# Altium schematic sheet flight_cont_card.SchDoc
size A3; SheetNumber: 1; SheetTotal: 1
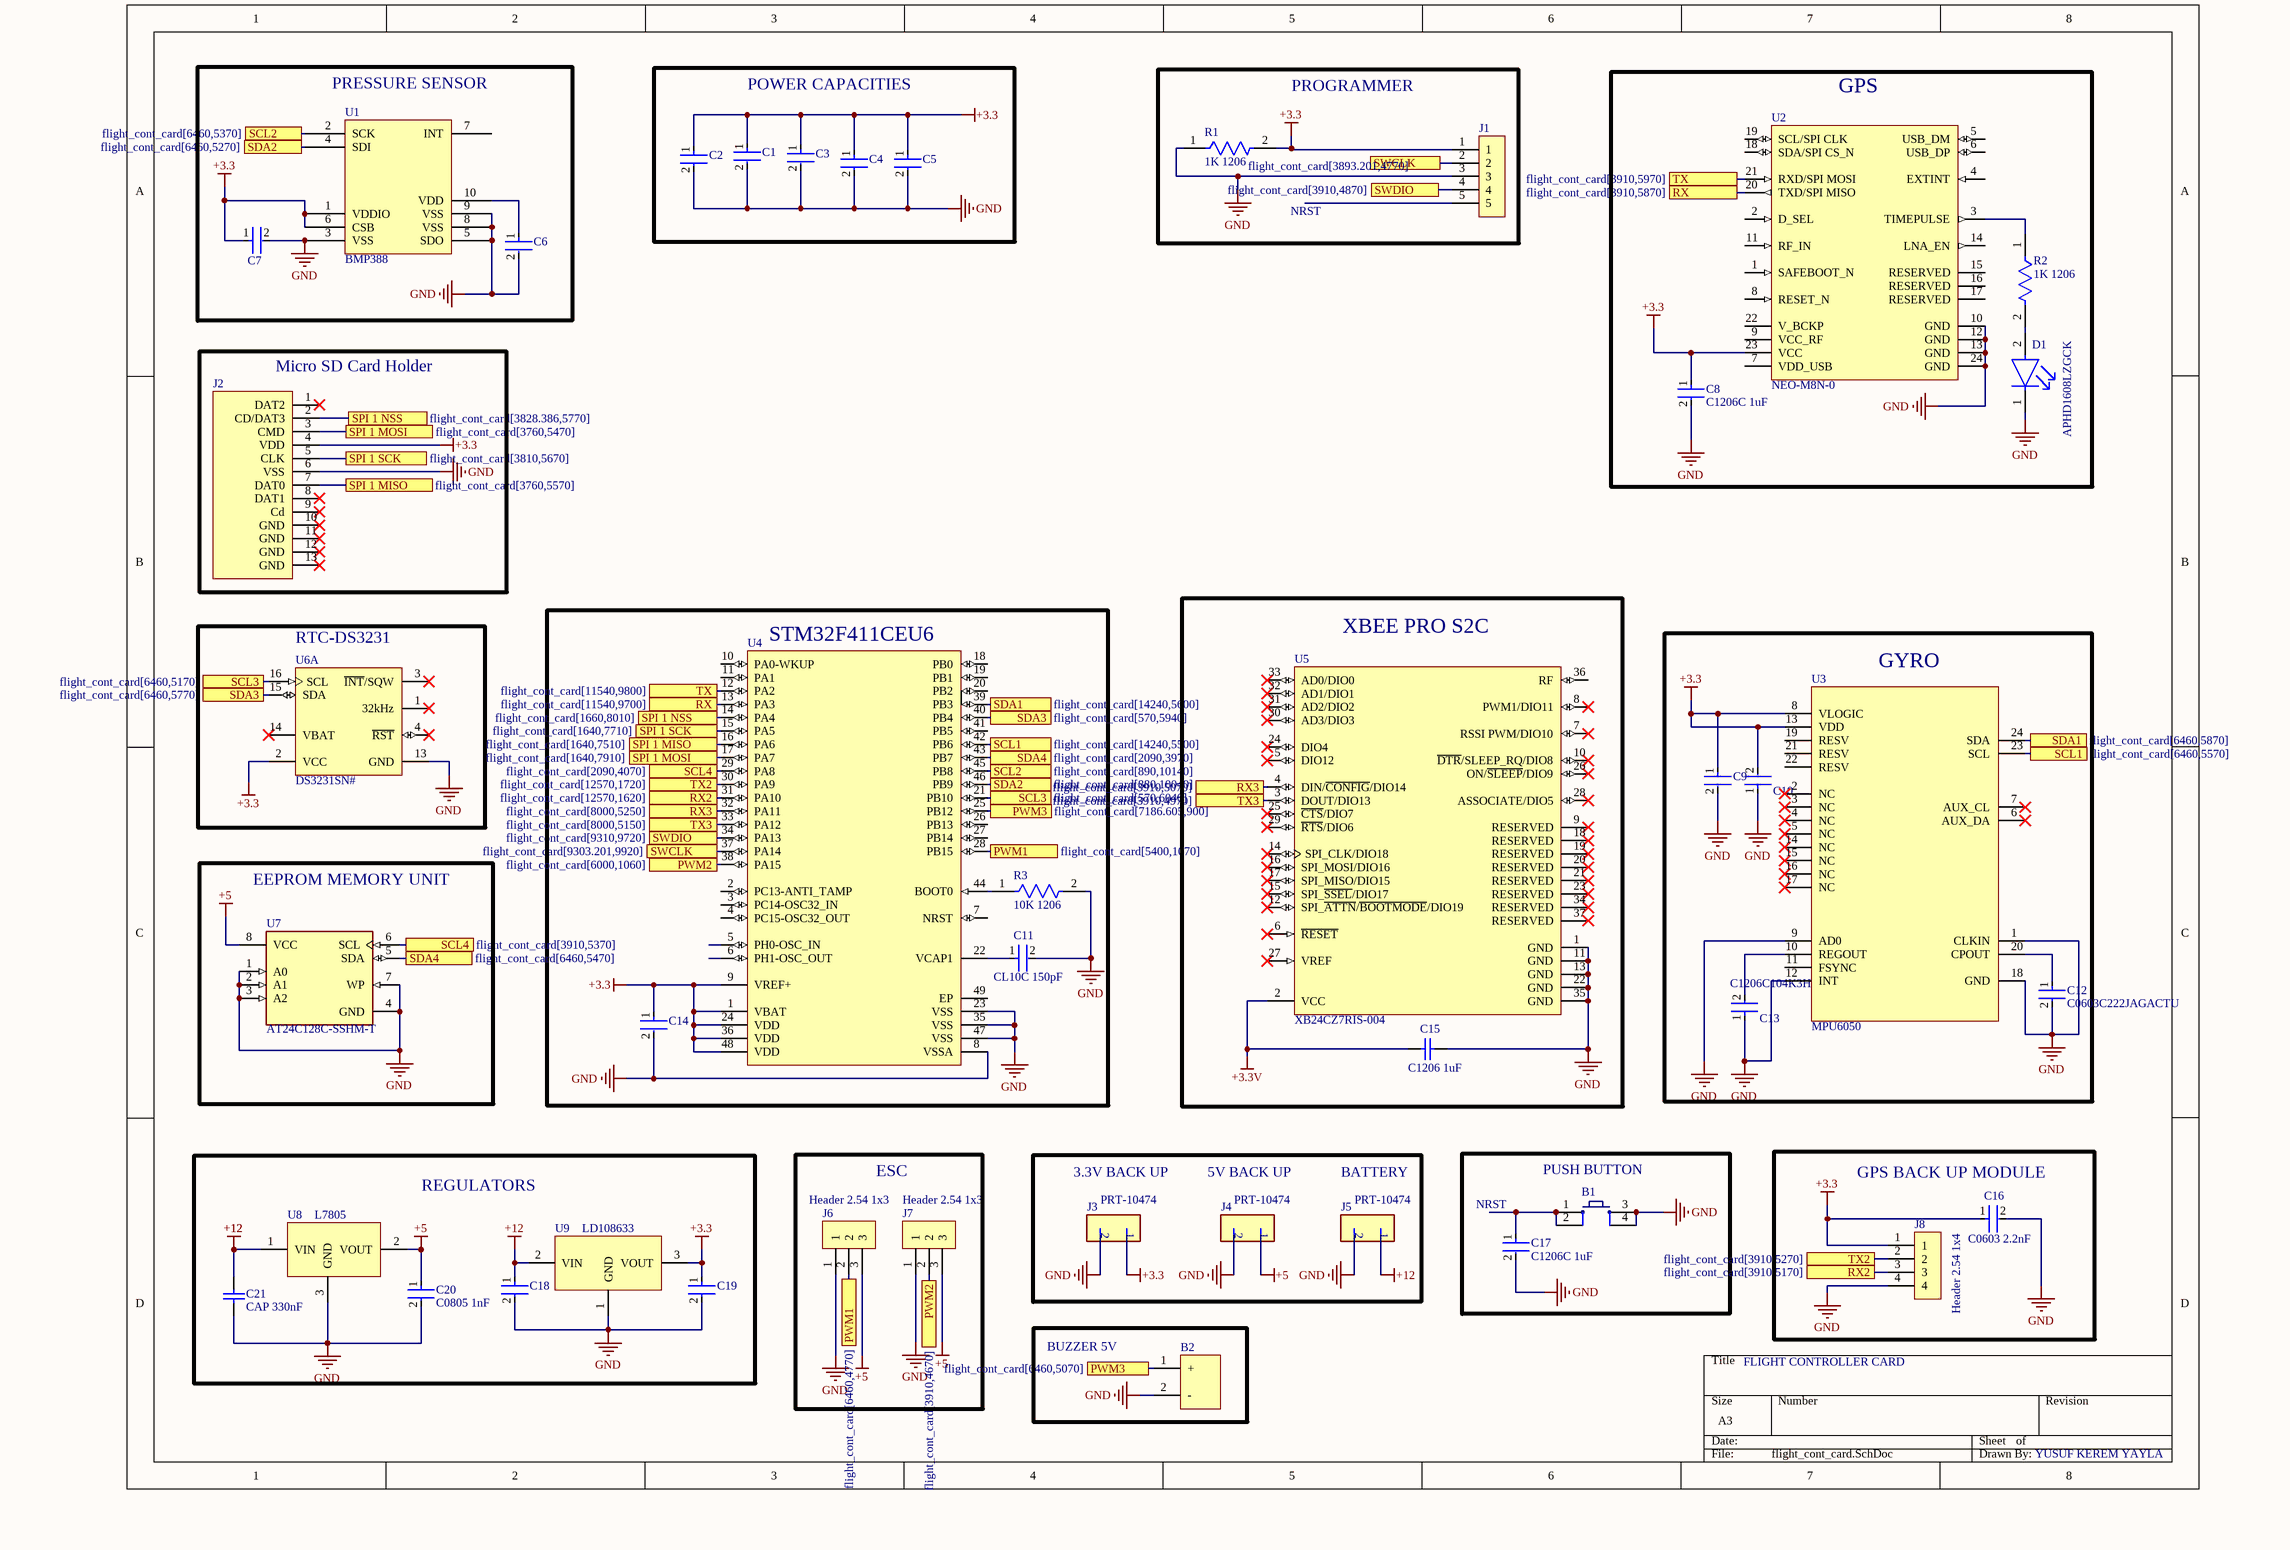
[diagram p0: flight_cont_card.SchDoc]

## Parts
B1  PUSH BUTTON  [PUSB BUTTON-SMD]
B2  BUZZER 5V  [Buzzer 5v]
C1  CGA5L1X7R1E106K160AC  [FP-CGA5L-0_3-0_1-IPC_B]  (value not drawn)
C2  CGA5L1X7R1E106K160AC  [FP-CGA5L-0_3-0_1-IPC_B]  (value not drawn)
C3  CGA5L1X7R1E106K160AC  [FP-CGA5L-0_3-0_1-IPC_B]  (value not drawn)
C4  CGA5L1X7R1E106K160AC  [FP-CGA5L-0_3-0_1-IPC_B]  (value not drawn)
C5  CGA5L1X7R1E106K160AC  [FP-CGA5L-0_3-0_1-IPC_B]  (value not drawn)
C6  CGA5L1X7R1E106K160AC  [FP-CGA5L-0_3-0_1-IPC_B]  (value not drawn)
C7  CGA5L1X7R1E106K160AC  [FP-CGA5L-0_3-0_1-IPC_B]  (value not drawn)
C8  C1206C 1uF  [FP-C1206C-EB-MFG]
C9  C1206C104K3HACTU  [FP-C1206C-EB-MFG]  (value not drawn)
C10  C1206C104K3HACTU  [FP-C1206C-EB-MFG]  (value not drawn)
C11  CL10C 150pF  [FP-CL10-IPC_A]
C12  C0603C222JAGACTU  [FP-C0603C-CF-MFG]
C13  C1206C104K3HACTU  [FP-C1206C-EB-MFG]
C14  08051C105K4T2A  [FP-0805-L_2_01_0_2-W_1_25-MFG]  (value not drawn)
C15  C1206 1uF  [CAPC3216X180X50ML20T25]
C16  C0603 2.2nF  [FP-C0603C-CF-MFG]
C17  C1206C 1uF  [FP-C1206C-EB-MFG]
C18  CGA5L1X7R1E106K160AC  [FP-CGA5L-0_3-0_1-IPC_B]  (value not drawn)
C19  CGA5L1X7R1E106K160AC  [FP-CGA5L-0_3-0_1-IPC_B]  (value not drawn)
C20  C0805 1nF  [FP-C0805C-DN-MFG]
C21  CAP 330nF  [CAPC2220(5750)190_N]
D1  APHD1608LZGCK  [FP-APHD1608LZGCK-MFG]
J1  Header 2.54 1x5  [Header 2.54 1x5]  (value not drawn)
J2  Micro SD Card Holder  [Micro SD Card Holder]
J3  PRT-10474  [FP-PRT-10474-MFG]
J4  PRT-10474  [FP-PRT-10474-MFG]
J5  PRT-10474  [FP-PRT-10474-MFG]
J6  Header 2.54 1x3  [Header 2.54 1x3]
J7  Header 2.54 1x3  [Header 2.54 1x3]
J8  Header 2.54 1x4  [Header 2.54 1x4]
R1  1K 1206  [FP-RMCF1206-IPC_A]
R2  1K 1206  [FP-RMCF1206-IPC_A]
R3  10K 1206  [FP-CRGP1206-IPC_C]
U1  BMP388  [BMP388]
U2  NEO-M8N-0  [UBX-NEO-M8-24_V]
U3  MPU6050  [QFN50P400X400X90_HS-25N]
U4  STM32F411CEU6  [STM-UFQFPN48_L]
U5  XB24CZ7RIS-004  [DIGI-XB24CZ7RIS-004-Module-37_V]
U6  DS3231SN#  [W16#H2_L]  (part A of 2)
U7  AT24C128C-SSHM-T  [FP-C04-057-SN-IPC_A]
U8  L7805  [DPAK228P972X230-3N]
U9  LD108633  [DPAK228P972X230-3N]

## Blocks framed on the sheet
PRESSURE SENSOR: C6 C7 U1
POWER CAPACITIES: C1-C5
PROGRAMMER: J1 R1
GPS: C8 D1 R2 U2
XBEE PRO S2C: C15 U5
RTC-DS3231: U6
GYRO: C9 C10 C12 C13 U3
EEPROM MEMORY UNIT: U7
REGULATORS: C18-C21 U8 U9
ESC: J6 J7
NRST: B1 C17
GPS BACK UP MODULE: C16 J8

## Ports
PWM1 (see flight_cont_card[5400,1070]), PWM1 (see flight_cont_card[6460,4770]), PWM2 (see flight_cont_card[3910,4670]), PWM2 (see flight_cont_card[6000,1060]), PWM3 (see flight_cont_card[6460,5070]), PWM3 (see flight_cont_card[7186.605,900]), RX2 (see flight_cont_card[3910,5170]), RX2 (see flight_cont_card[12570,1620]), RX3 (see flight_cont_card[3910,5070]), RX3 (see flight_cont_card[8000,5250]), RX (see flight_cont_card[3910,5870]), RX (see flight_cont_card[11540,9700]), SCL1 (see flight_cont_card[6460,5570]), SCL1 (see flight_cont_card[14240,5500]), SCL2 (see flight_cont_card[890,10140]), SCL2 (see flight_cont_card[6460,5370]), SCL3 (see flight_cont_card[570,6040]), SCL3 (see flight_cont_card[6460,5170]), SCL4 (see flight_cont_card[2090,4070]), SCL4 (see flight_cont_card[3910,5370]), SDA1 (see flight_cont_card[6460,5870]), SDA1 (see flight_cont_card[14240,5600]), SDA2 (see flight_cont_card[880,10040]), SDA2 (see flight_cont_card[6460,5270]), SDA3 (see flight_cont_card[570,5940]), SDA3 (see flight_cont_card[6460,5770]), SDA4 (see flight_cont_card[2090,3970]), SDA4 (see flight_cont_card[6460,5470]), SPI 1 MISO (see flight_cont_card[1640,7510]), SPI 1 MISO (see flight_cont_card[3760,5570]), SPI 1 MOSI (see flight_cont_card[1640,7910]), SPI 1 MOSI (see flight_cont_card[3760,5470]), SPI 1 NSS (see flight_cont_card[1660,8010]), SPI 1 NSS (see flight_cont_card[3828.386,5770]), SPI 1 SCK (see flight_cont_card[1640,7710]), SPI 1 SCK (see flight_cont_card[3810,5670]), SWCLK (see flight_cont_card[3893.201,4770]), SWCLK (see flight_cont_card[9303.201,9920]), SWDIO (see flight_cont_card[3910,4870]), SWDIO (see flight_cont_card[9310,9720]), TX2 (see flight_cont_card[3910,5270]), TX2 (see flight_cont_card[12570,1720]), TX3 (see flight_cont_card[3910,4970]), TX3 (see flight_cont_card[8000,5150]), TX (see flight_cont_card[3910,5970]), TX (see flight_cont_card[11540,9800])

## Nets
+3.3: C1.1 C2.1 C3.1 C4.1 C5.1 C7.1 C8.1 C9.1 C10.2 C14.1 C16.1 C19.1 J1.1 J2.4(VDD) J8.1 R1.2 U1.1(VDDIO) U1.6(CSB) U2.23(VCC) U3.8(VLOGIC) U3.13(VDD) U4.1(VBAT) U4.9(VREF+) U4.24(VDD) U4.36(VDD) U4.48(VDD) U6.2(VCC) U9.3(VOUT)
+3.3V: C15.1 U5.2(VCC)
+5: C20.1 J6.3 J7.3 U7.8(VCC) U8.2(VOUT)
+12: C18.1 C21.2 U8.1(VIN) U9.2(VIN)
GND: B1.3 B1.4 B2.2(-) C1.2 C2.2 C3.2 C4.2 C5.2 C6.2 C7.2 C8.2 C9.2 C10.1 C11.2 C12.2 C13.1 C14.2 C15.2 C16.2 C17.2 C18.2 C19.2 C20.2 C21.1 D1.1(C) J1.3 J2.6(VSS) J6.1 J7.1 J8.4 R1.1 R3.2 U1.3(VSS) U1.5(SDO) U1.8(VSS) U1.9(VSS) U2.10(GND) U2.12(GND) U2.13(GND) U2.24(GND) U3.1(CLKIN) U3.9(AD0) U3.12(INT) U3.18(GND) U4.8(VSSA) U4.23(VSS) U4.35(VSS) U4.47(VSS) U5.1(GND) U5.11(GND) U5.13(GND) U5.22(GND) U5.35(GND) U6.13(GND) U7.1(A0) U7.2(A1) U7.3(A2) U7.4(GND) U7.7(WP) U8.3(GND) U9.1(GND)
PWM1: J6.2 U4.28(PB15) ; port PWM1
PWM2: J7.2 U4.38(PA15) ; port PWM2
PWM3: B2.1(+) U4.25(PB12) ; port PWM3
RX: U2.20(TXD/SPI_MISO) U4.13(PA3) ; port RX
RX2: J8.3 U4.31(PA10) ; port RX2
RX3: U4.32(PA11) U5.4(DIN/~{CONFIG}/DIO14) ; port RX3
SCL1: U3.23(SCL) U4.42(PB6) ; port SCL1
SCL2: U1.2(SCK) U4.45(PB8) ; port SCL2
SCL3: U4.21(PB10) U6.16(SCL) ; port SCL3
SCL4: U4.29(PA8) U7.6(SCL) ; port SCL4
SDA1: U3.24(SDA) U4.39(PB3) ; port SDA1
SDA2: U1.4(SDI) U4.46(PB9) ; port SDA2
SDA3: U4.40(PB4) U6.15(SDA) ; port SDA3
SDA4: U4.43(PB7) U7.5(SDA) ; port SDA4
SPI 1 MISO: J2.7(DAT0) U4.16(PA6) ; port SPI 1 MISO
SPI 1 MOSI: J2.3(CMD) U4.17(PA7) ; port SPI 1 MOSI
SPI 1 NSS: J2.2(CD/DAT3) U4.14(PA4) ; port SPI 1 NSS
SPI 1 SCK: J2.5(CLK) U4.15(PA5) ; port SPI 1 SCK
SWCLK: J1.2 U4.37(PA14) ; port SWCLK
SWDIO: J1.4 U4.34(PA13) ; port SWDIO
TX: U2.21(RXD/SPI_MOSI) U4.12(PA2) ; port TX
TX2: J8.2 U4.30(PA9) ; port TX2
TX3: U4.33(PA12) U5.3(DOUT/DIO13) ; port TX3
NetB1_1: B1.1 B1.2 C17.1
NetC6_1: C6.1 U1.10(VDD)
NetC11_1: C11.1 U4.22(VCAP1)
NetC12_1: C12.1 U3.20(CPOUT)
NetC13_2: C13.2 U3.10(REGOUT)
NetD1_2: D1.2(A) R2.2
NetR2_1: R2.1 U2.3(TIMEPULSE)
NetR3_1: R3.1 U4.44(BOOT0)

Not connected (* = marked no-connect by the designer): J1 5; J2 1(DAT2)* 8(DAT1)* 9(Cd)* 10(GND)* 11(GND)* 12(GND)* 13(GND)*; U1 7(INT); U2 1(SAFEBOOT_N) 2(D_SEL) 4(EXTINT) 5(USB_DM) 6(USB_DP) 7(VDD_USB) 8(RESET_N) 9(VCC_RF) 11(RF_IN) 14(LNA_EN) 15(RESERVED) 16(RESERVED) 17(RESERVED) 18(SDA/SPI_CS_N) 19(SCL/SPI_CLK) 22(V_BCKP); U3 2(NC)* 3(NC)* 4(NC)* 5(NC)* 6(AUX_DA)* 7(AUX_CL)* 11(FSYNC) 14(NC)* 15(NC)* 16(NC)* 17(NC)* 19(RESV) 21(RESV) 22(RESV); U4 2(PC13-ANTI_TAMP) 3(PC14-OSC32_IN) 4(PC15-OSC32_OUT) 5(PH0-OSC_IN) 6(PH1-OSC_OUT) 7(NRST) 10(PA0-WKUP) 11(PA1) 18(PB0) 19(PB1) 20(PB2) 26(PB13) 27(PB14) 41(PB5) 49(EP); U5 5(DIO12)* 6(~{RESET})* 7(RSSI_PWM/DIO10)* 8(PWM1/DIO11)* 9(RESERVED)* 10(~{DTR}/SLEEP_RQ/DIO8)* 12(SPI_~{ATTN}/~{BOOTMODE}/DIO19)* 14(SPI_CLK/DIO18)* 15(SPI_~{SSEL}/DIO17)* 16(SPI_MOSI/DIO16)* 17(SPI_MISO/DIO15)* 18(RESERVED)* 19(RESERVED)* 20(RESERVED)* 21(RESERVED)* 23(RESERVED)* 24(DIO4)* 25(~{CTS}/DIO7)* 26(ON/~{SLEEP}/DIO9)* 27(VREF)* 28(ASSOCIATE/DIO5)* 29(~{RTS}/DIO6)* 30(AD3/DIO3)* 31(AD2/DIO2)* 32(AD1/DIO1)* 33(AD0/DIO0)* 34(RESERVED)* 36(RF) 37(RESERVED)*; U6 1(32kHz)* 3(~{INT}/SQW)* 4(~{RST})* 14(VBAT)*

## Notes on the sheet
- NRST
- 3.3V BACK UP
- 5V BACK UP
- BATTERY
- FLIGHT CONTROLLER CARD
- YUSUF KEREM YAYLA
- (in symbol CMP-157536-000001-1) 2; 1

## Library data of the parts
B1 = Push Button: Smd Push Button; Satın Alma Linki: https://urun.n11.com/diger/mini-pushbutton-switch-smd-P227461537?gclid=Cj0KCQjwkoDmBRCcARIsAG3xzl8Y_-jeD7HocNM6lvuZ_rVp83568XPGtNzlPwXWLph8oCRqo0yh87UaApZYEALw_wcB&gclsrc=aw.ds
C1-C7 C18 C19 = CMP-08246-002126-1: Cap Ceramic 10uF 25V X7R 10% Pad SMD 1206 +125°C Automotive T/R; Case/Package: 1206; Thickness: 0.075inch; Ratings: AEC-Q200; Packaging: Tape and Reel; REACH SVHC: No SVHC; Composition: Ceramic; Tolerance: 10%; Capacitance: 10uF; Depth: 1.6mm; Lead Free: Lead Free; Termination: SMD/SMT; Package Quantity: 1; Dielectric: X7R; Length: 3.2mm; Min Operating Temperature: -55°C; Voltage Rating: 25V; Max Operating Temperature: 125°C; Mount: Surface Mount; Case Code (Metric): 3216; Height: 1.6mm; Weight: 0.000571oz; Width: 0.063inch; Voltage Rating (DC): 25V; Case Code (Imperial): 1206
C8 C17 = CMP-1037-04220-3: CAP CER 0.1UF 200V X7R 1206; Manufacturer: KEMET; Manufacturer Part Number: C1206C104J2RACTU; Automotive Grade: Grade 0; Value: 0.10 μF; Temperature Coefficient: 15%; Material: Ceramic; Tolerance: 0.05; Digikey Description: CAP CER 0.1UF 200V X7R 1206; Lead Free: Yes; Ipc Land Pattern Name: CAPC320160X78; Voltage Rating: 200 V; ComponentLink2URL: https://content.kemet.com/datasheets/KEM_C1007_X8R_ULTRA_150C_SMD.pdf; Device Class L1: Passive Components; RoHS: TRUE; Device Class L3: Ceramic Capacitors; Package: C1206C-EB; Height: 0.88mm; Temperature: -55°C to +150°C; Temperature Range High: +150°C; Capacitance: 0.10 μF; ComponentLink2Description: Datasheet; Automotive: Yes; Temperature Range Low: -55°C; Temperature Characteristic: X7R; Device Class L2: Capacitors; Octopart: https://octopart.com/c1206c104j2ractu-kemet-10471706; Category: Cap
C9 C10 = CMP-03020-004792-1: CAP CER 0.1UF 25V X8R 1206; Manufacturer: KEMET; Value: 0.10 μF; Automotive Grade: Grade 0; Tolerance: 0.1; Material: Ceramic; Temperature Coefficient: 15%; Device Class L1: Passive Components; Category: Cap; RoHS: TRUE; Voltage Rating: 25 V; Capacitance: 0.10 μF; Height: 0.88mm; Lead Free: Yes; Temperature: -55°C to +150°C; Device Class L3: Ceramic Capacitors; ComponentLink2Description: Datasheet; Ipc Land Pattern Name: CAPC320160X78; ComponentLink2URL: https://content.kemet.com/datasheets/KEM_C1007_X8R_ULTRA_150C_SMD.pdf; Temperature Range High: +150°C; Digikey Description: CAP CER 0.1UF 25V X8R 1206; Octopart: https://octopart.com/c1206c104k3hactu-kemet-12793234; Temperature Characteristic: X8R; Device Class L2: Capacitors; Manufacturer Part Number: C1206C104K3HACTU; Automotive: Yes; Temperature Range Low: -55°C; Mouser Description: Multilayer Ceramic Capacitors MLCC - SMD/SMT 25V 100000pF +/-10% X8R; Package: C1206C-EB
C11 = CMP-13271-003916-1: Cap Ceramic 150pF 50V C0G ±5% Pad SMD 0603 +125°C T/R; Min Operating Temperature: -55°C; Case Code (Metric): 1608; Max Operating Temperature: 125°C; Dielectric: C0G; Voltage Rating: 50V; Radiation Hardening: No; Length: 0.063inch; Depth: 0.8mm; Thickness: 0.035inch; Packaging: Tape and Reel; Tolerance: 5%; Capacitance: 150pF; Case/Package: 0603; Width: 0.031inch; Height: 0.8mm; Mount: Surface Mount; Package Quantity: 1; Case Code (Imperial): 0603
C12 = CMP-03020-006235-1: C0603 2,200 pF C0G 30ppm/°C 5.00% 250 V; Manufacturer: KEMET; Voltage Rating: 250 V; Tolerance: 0.05; Material: Ceramic; Automotive Grade: Grade 1; Manufacturer Part Number: C0603C222JAGACTU; Temperature Coefficient: 30ppm/°C; Temperature Range High: +125°C; Device Class L3: Ceramic Capacitors; Device Class L2: Capacitors; Temperature Range Low: -55°C; Height: 0.87mm; RoHS: TRUE; Package: C0603C-CF; Category: Cap; Temperature Characteristic: C0G; ComponentLink2Description: Datasheet; Temperature: -55°C to +125°C; Mouser Description: Multilayer Ceramic Capacitors MLCC - SMD/SMT 250volts 2.2nF 5% C0G; Capacitance: 2,200 pF; ComponentLink2URL: https://api.kemet.com/component-edge/download/datasheet/C0603C100J5GACAUTO.pdf; Lead Free: Yes; Automotive: Yes; Device Class L1: Passive Components; Octopart: https://octopart.com/c0603c222jagactu-kemet-88369381; Value: 2,200 pF
C13 = CMP-03020-004792-1: 0.1 uF; Manufacturer: KEMET; Value: 0.10 μF; Automotive Grade: Grade 0; Voltage Rating: 25 V; Tolerance: 0.1; Material: Ceramic; Temperature Characteristic: X8R; Temperature Coefficient: 15%; Device Class L1: Passive Components; Category: Cap; RoHS: TRUE; Capacitance: 0.10 μF; Height: 0.88mm; Lead Free: Yes; Temperature: -55°C to +150°C; Device Class L3: Ceramic Capacitors; ComponentLink2Description: Datasheet; Ipc Land Pattern Name: CAPC320160X78; ComponentLink2URL: https://content.kemet.com/datasheets/KEM_C1007_X8R_ULTRA_150C_SMD.pdf; Temperature Range High: +150°C; Digikey Description: CAP CER 0.1UF 25V X8R 1206; Octopart: https://octopart.com/c1206c104k3hactu-kemet-12793234; Device Class L2: Capacitors; Manufacturer Part Number: C1206C104K3HACTU; Automotive: Yes; Temperature Range Low: -55°C; Mouser Description: Multilayer Ceramic Capacitors MLCC - SMD/SMT 25V 100000pF +/-10% X8R; Package: C1206C-EB
C14 = CMP-07738-122049624-1: 08051C105K4T2A Cap Ceramic 1uF 100V X7R 10% Pad SMD 0805 125C Automotive T/R; Capacitance: 1µF; Tolerance: 10%; Dielectric: X7R; Case/Package: 0805; Material: Ceramic; Height: 1.4mm; Voltage Rating (DC): 100V; Voltage Rating: 100V; Schedule B: 8532240020; NexarPartId: 122049624; RoHS: Compliant; Lifecycle Status: Production; Min Operating Temperature: -55°C; Max Operating Temperature: 125°C
C15 = CMP-2000-04991-1: Chip Capacitor, 1 uF, +/- 10%, 25 V, -55 to 125 degC, 1206 (3216 Metric), RoHS, Tape and Reel; Manufacturer: Kemet; Temperature Coefficient / Code: +/-15%; Dielectric: X7R; Voltage Rating DC: 25V; Capacitance - nF: 1000nF; Class: Class1; Case Length: 3.2mm; Type: SMDMLCCX7R6.3-250VDCCommericalGrade; Case Width: 1.6mm; Product: GeneralTypeMLCCs; Capacitance: 1uF; Datasheet URL: https://ciiva.com/datasheet-click-18194173?src=ciiva&sig=6daff8c4; Operating Temperature Range: -55Cto+125C; Series: C1206C; RoHS: Details; Product Category: MultilayerCeramicCapacitorsMLCC-SMD/SMT; Manufacturer URL: http://www.kemet.com/; Minimum Operating Temperature: -55C; Dimensions: 1.6mmWx3.2mmLx1.6mmH; Termination Style: SMD/SMT; Brand: Kemet; Packaging: Reel; Package / Case: 1206(3216metric); Case Code - mm: 3216; Datasheet Version: Jul-14; Factory Pack Quantity: 2000; Package Description: 2-Pin Surface Mount Device, Body 3.2 x 1.6 mm; Tolerance: 10%; Package Reference: 1206; Case Height: 1.6mm; Case Code - in: 1206; Maximum Operating Temperature: +125C; Voltage Rating: 25V
C16 = CMP-03020-006235-1: C0603 2,200 pF C0G 30ppm/°C 5.00% 250 V; Manufacturer Part Number: C0603C222JAGACTU; Manufacturer: KEMET; Voltage Rating: 250 V; Tolerance: 0.05; Material: Ceramic; Automotive Grade: Grade 1; Temperature Coefficient: 30ppm/°C; Temperature Range High: +125°C; Device Class L3: Ceramic Capacitors; Device Class L2: Capacitors; Temperature Range Low: -55°C; Height: 0.87mm; RoHS: TRUE; Package: C0603C-CF; Category: Cap; Temperature Characteristic: C0G; ComponentLink2Description: Datasheet; Temperature: -55°C to +125°C; Mouser Description: Multilayer Ceramic Capacitors MLCC - SMD/SMT 250volts 2.2nF 5% C0G; Capacitance: 2,200 pF; ComponentLink2URL: https://api.kemet.com/component-edge/download/datasheet/C0603C100J5GACAUTO.pdf; Lead Free: Yes; Automotive: Yes; Device Class L1: Passive Components; Octopart: https://octopart.com/c0603c222jagactu-kemet-88369381; Value: 2,200 pF
C20 = CMP-1036-02994-3: CAP CER 1000PF 100V X7R 0805; Manufacturer Part Number: C0805C102M1RACTU; Manufacturer: KEMET; Value: 1,000 pF; Material: Ceramic; Tolerance: 0.2; Temperature Coefficient: 30ppm/°C; Mouser Description: Multilayer Ceramic Capacitors MLCC - SMD/SMT 100volts 1000pF X7R 20%; Device Class L1: Passive Components; Ipc Land Pattern Name: CAPC200125X78; Automotive: No; Temperature Range Low: -55°C; Octopart: https://octopart.com/c0805c102m1ractu-kemet-9143290; Device Class L3: Ceramic Capacitors; Digikey Description: CAP CER 1000PF 100V X7R 0805; Capacitance: 1,000 pF; Temperature: -55°C to +125°C; Package: C0805C-DN; ComponentLink2URL: https://content.kemet.com/datasheets/KEM_C1003_C0G_SMD.pdf; Voltage Rating: 100 V; Category: Cap; Temperature Range High: +125°C; Temperature Characteristic: X7R; ComponentLink2Description: Datasheet; Height: 0.88mm; RoHS: TRUE; Device Class L2: Capacitors; Lead Free: Yes
C21 = CMP-1042-00601-2: CAP 330nF 100V ±10% 2220 (5750 Metric) Thickness 1.85mm SMD; Case-Metric: 5750; Tolerance: Â±10%; Case-EIA: 2220; Max Thickness: 1.85 mm; Rated Voltage: 100 V; Value: 330nF; Technology: SMT
D1 = CMP-44529-000045-1: LED GREEN CLEAR 1608 SMD; Test Current: 2mA; Dominant Wavelength: 525nm; Lens Color: Colorless; Luminous Intensity: 180mcd; Viewing Angle: 100°; Forward Voltage: 2.65V; Lens Size: 0.7mm; Lens Style: Round; Mount: Surface Mount; Packaging: Tape and Reel; Lens Transparency: Clear; Height: 0.75mm; Case/Package: 0603; Length: 1.6mm; Case Code (Metric): 1608; Width: 0.8mm; Color: Green; Case Code (Imperial): 0603
J3-J5 = CMP-157536-000001-1: XT60 CONNECTORS MALE/FEMALE PAIR
R1 R2 = CMP-26527-006126-1: 1kΩ ±5% 0.25W 1206 Thick Film Chip Resistor AEC-Q200 compliant; Resistance: 1kR; Max Power Dissipation: 250mW; Temperature Coefficient: 200ppm/°C; Resistor Type: Thick Film; Height: 0.028inch; Max Operating Temperature: 155°C; Features: Automotive AEC-Q200; Case/Package: 1206; Mount: Surface Mount; Series: RMCF; Min Operating Temperature: -55°C; Packaging: Tape and Reel; Contact Plating: Tin; Length: 0.126inch; Number of Terminations: 2; Radiation Hardening: No; Width: 0.063inch; Case Code (Metric): 3216; Case Code (Imperial): 1206; RoHS Compliant: Yes; Tolerance: 5%
R3 = CMP-03211-004788-1: CRGP 1206 10K 1%; Manufacturer Part Number: CRGP1206F10K; Manufacturer: TE; Temperature Coefficient: ±100ppm/°C; Resistance: 10KΩ; Value: 10KΩ; Tolerance: 0.01; Power Rating: 0.5W; Voltage Rating: 200V; Package: CRGP1206; Ambient Temperature Range High: +70°C; Device Class L2: Resistors; Lead Free: Yes; Automotive: No; Series: CRGP; Temperature Range High: +155°C; Ipc Land Pattern Name: RESC310155X55; Device Class L1: Passive Components; Octopart: https://octopart.com/crgp1206f10k-te+connectivity-91018843; Temperature: -55°C to +155°C; Category: Res; Height: 0.65mm; Temperature Range Low: -55°C; RoHS: TRUE; Digikey Description: CRGP 1206 10K 1%; Device Class L3: Chip SMD Resistors; Composition: Thick Film; ComponentLink2URL: https://www.mouser.com/datasheet/2/418/NG_DS_9-1773463-9_A-1358566.pdf; ComponentLink2Description: Datasheet
U2 = CMP-2000-07559-1: U-Blox M8 Concurrent Gnss Module, 3.6 V, -40 to 85 degC, 24-Pin SMD, RoHS, Tape and Reel; Mounting Technology: SurfaceMount; Manufacturer: U-Blox; Manufacturer URL: https://www.u-blox.com/en; Package Reference: NEO-M8N-0; Datasheet Version: Rev. R03, 08/2016; RoHSCompliant: False; Package URL: https://www.u-blox.com/sites/default/files/NEO-8Q-NEO-M8-FW3_HardwareIntegrationManual_%28UBX-15029985%29.pdf; Datasheet URL: https://www.u-blox.com/sites/default/files/NEO-M8-FW3_DataSheet_%28UBX-15031086%29.pdf; Package Description: 24-Pin Surface Mount Device, Body 16 x 12.2 mm, Pitch 1.1 mm
U3 = MPU6050: MPU6050 GYRO
U4 = CMP-0243-00165-1: ARM Cortex-M4 32-bit MCU+FPU, 512 KB Flash, 128 KB RAM, 36 I/Os, 48-Pin UFQFPN, -40 to 85 degC, Tray; Operating Frequency(F) (Processor speed) (MHz): 100; FLASH Size (Prog) (kB): 512; Internal RAM Size (kB): 128; I/Os (High Current): 36; Supply Voltage(Vcc) min (V): 1.7; Package Reference: 48-Pin Ultra Thin Fine Pitch Quad Flat No-Lead, 7 x 7 x 0.6 mm Body, 0.5 mm Pitch, Exposed Pad; ComponentLink1Description: Manufacturer URL; ComponentLink1URL: http://www.st.com/; Packing: Tray; Package Description: UFQFPN48; Core: ARM Cortex-M4; ComponentLink2Description: Datasheet; ComponentLink2URL: http://www.st.com/st-web-ui/static/active/en/resource/technical/document/datasheet/DM00115249.pdf; DatasheetVersion: Rev. 6; Mounting Technology: Surface Mount
U5 = CMP-0009-00001-1: XBee ZB SMT RF Module, 2.4 GHz, 250 kbps, -100 dBm, 2.1 to 3.6 V, 28 mA, 3.1 mW, -40 to 85 degC, 37-Pin Module, RoHS; Manufacturer: Digi international; Operating Current (Receive): 28 mA; Transmit Power Output: 3.1 mW; Indoor/Urban Range: Up to 200 ft. (60 m); RF Data Rate: 250000 bps; Operating Frequency Band: ISM 2.4 to 2.5 GHz; Outdoor RF line-of-sight Range: Up to 4000 ft. (1200 m); Operating Temperature: -40 to 85 degC; Supply Voltage: 2.1 to 3.6 V; ComponentLink3URL: http://ftp1.digi.com/support/documentation/90002002_K.pdf; ROHS: TRUE; PackageDescription: 37-Pin Module, Body 21.996 x 33.782 mm, Pitch 2.007 mm; PackageReference: XB24CZ7RIS-004-Module-37; DatasheetVersion: Sep-13; ComponentLink3Description: Package Specification; Receiver Sensitivity: -100 dBm; ComponentLink2URL: http://ftp1.digi.com/support/documentation/90002002_K.pdf; PartNumber: XB24CZ7RIS-004; Mounting Technology: Surface Mount; ComponentLink1Description: Manufacturer URL; ComponentLink2Description: Datasheet; PackageVersion: 6/9/2013; ComponentLink1URL: http://www.digi.com/
U6 = CMP-0254-00293-2: Extremely Accurate I2C-Integrated Real-Time Clock/TCXO/Crystal, 16-Pin SO, -40 to 85 degC, RoHS Qualified; Code_IPC: SOIC127P1030-16; ComponentLink2URL: http://datasheets.maxim-ic.com/en/ds/DS3231.pdf; Code_JEDEC: MS-013-AA; ComponentLink1URL: http://www.maxim-ic.com; ComponentLink2Description: Datasheet; ComponentLink3Description: Package Specification; DatasheetVersion: Rev 8, Jul-2010; PackageVersion: revD, 2010; ComponentLink1Description: Manufacturer URL; PackageDescription: 16-Pin Small-Outline IC, Wide (0.3in), 1.27 mm Pitch, SOIC (W), RoHS Qualified; ComponentLink3URL: http://pdfserv.maxim-ic.com/package_dwgs/21-0042.PDF; PackageReference: W16#H2
U7 = CMP-06313-000091-1: IC EEPROM 128K I2C 1MHZ 8SOIC; Access Time: 550ns; Memory Type: Non-Volatile; Memory Size: 128Kb; Packaging: Cut Tape; Case/Package: SOIC; Min Operating Temperature: -40°C; Max Operating Temperature: 85°C; Mount: Surface Mount; Number of Pins: 8; Frequency: 1MHz
U8 = L7805-DPAK: L7805 5V REGULATOR. SMD PAKET
U9 = LD108633 DPAK: LD1086 3.3V REGULATOR; Parameter 1: *